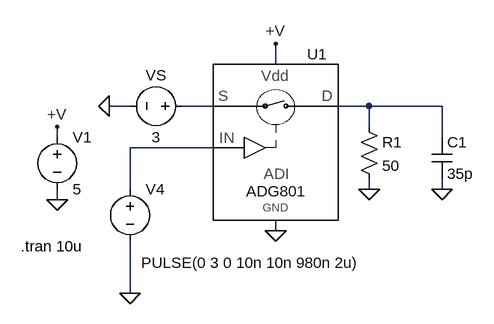
[diagram p0: schematic ADG801.asc]
ADG801.asc, the LTspice schematic file:
Version 4
SHEET 1 2844 1336
WIRE -144 -80 -144 -112
WIRE -368 -16 -400 -16
WIRE -240 -16 -288 -16
WIRE 0 -16 -48 -16
WIRE 112 -16 0 -16
WIRE 0 16 0 -16
WIRE -480 32 -480 16
WIRE 112 32 112 -16
WIRE -240 48 -368 48
WIRE -368 112 -368 48
WIRE 0 112 0 96
WIRE 112 112 112 96
WIRE -480 128 -480 112
WIRE -144 176 -144 160
WIRE -368 272 -368 192
FLAG -480 128 0
FLAG -480 16 +V
FLAG -400 -16 0
FLAG -144 -112 +V
FLAG -144 176 0
FLAG -368 272 0
FLAG 0 112 0
FLAG 112 112 0
SYMBOL voltage -480 16 R0
WINDOW 123 0 0 Left 0
WINDOW 39 0 0 Left 0
SYMATTR InstName V1
SYMATTR Value 5
SYMBOL voltage -272 -16 M270
WINDOW 0 32 56 VTop 2
WINDOW 3 -32 56 VBottom 2
WINDOW 123 0 0 Left 0
WINDOW 39 0 0 Left 0
SYMATTR InstName VS
SYMATTR Value 3
SYMBOL voltage -368 96 R0
WINDOW 3 17 129 Left 2
WINDOW 123 0 0 Left 0
WINDOW 39 0 0 Left 0
SYMATTR Value PULSE(0 3 0 10n 10n 980n 2u)
SYMATTR InstName V4
SYMBOL res -16 0 R0
SYMATTR InstName R1
SYMATTR Value 50
SYMBOL cap 96 32 R0
SYMATTR InstName C1
SYMATTR Value 35p
SYMBOL ADG801 -144 32 R0
SYMATTR InstName U1
TEXT -536 200 Left 2 !.tran 10u

The netlist it stands for:
* ADG801.asc
V1 +V 0 5
VS N001 0 3
V4 N003 0 PULSE(0 3 0 10n 10n 980n 2u)
R1 N002 0 50
C1 N002 0 35p
XU1 N003 N002 N001 0 +V ADG801  ; pins IN D S GND Vdd
.tran 10u
.lib ADG801.sub
.backanno
.end